# Altium project PCB_WMR_Project.PrjPcb
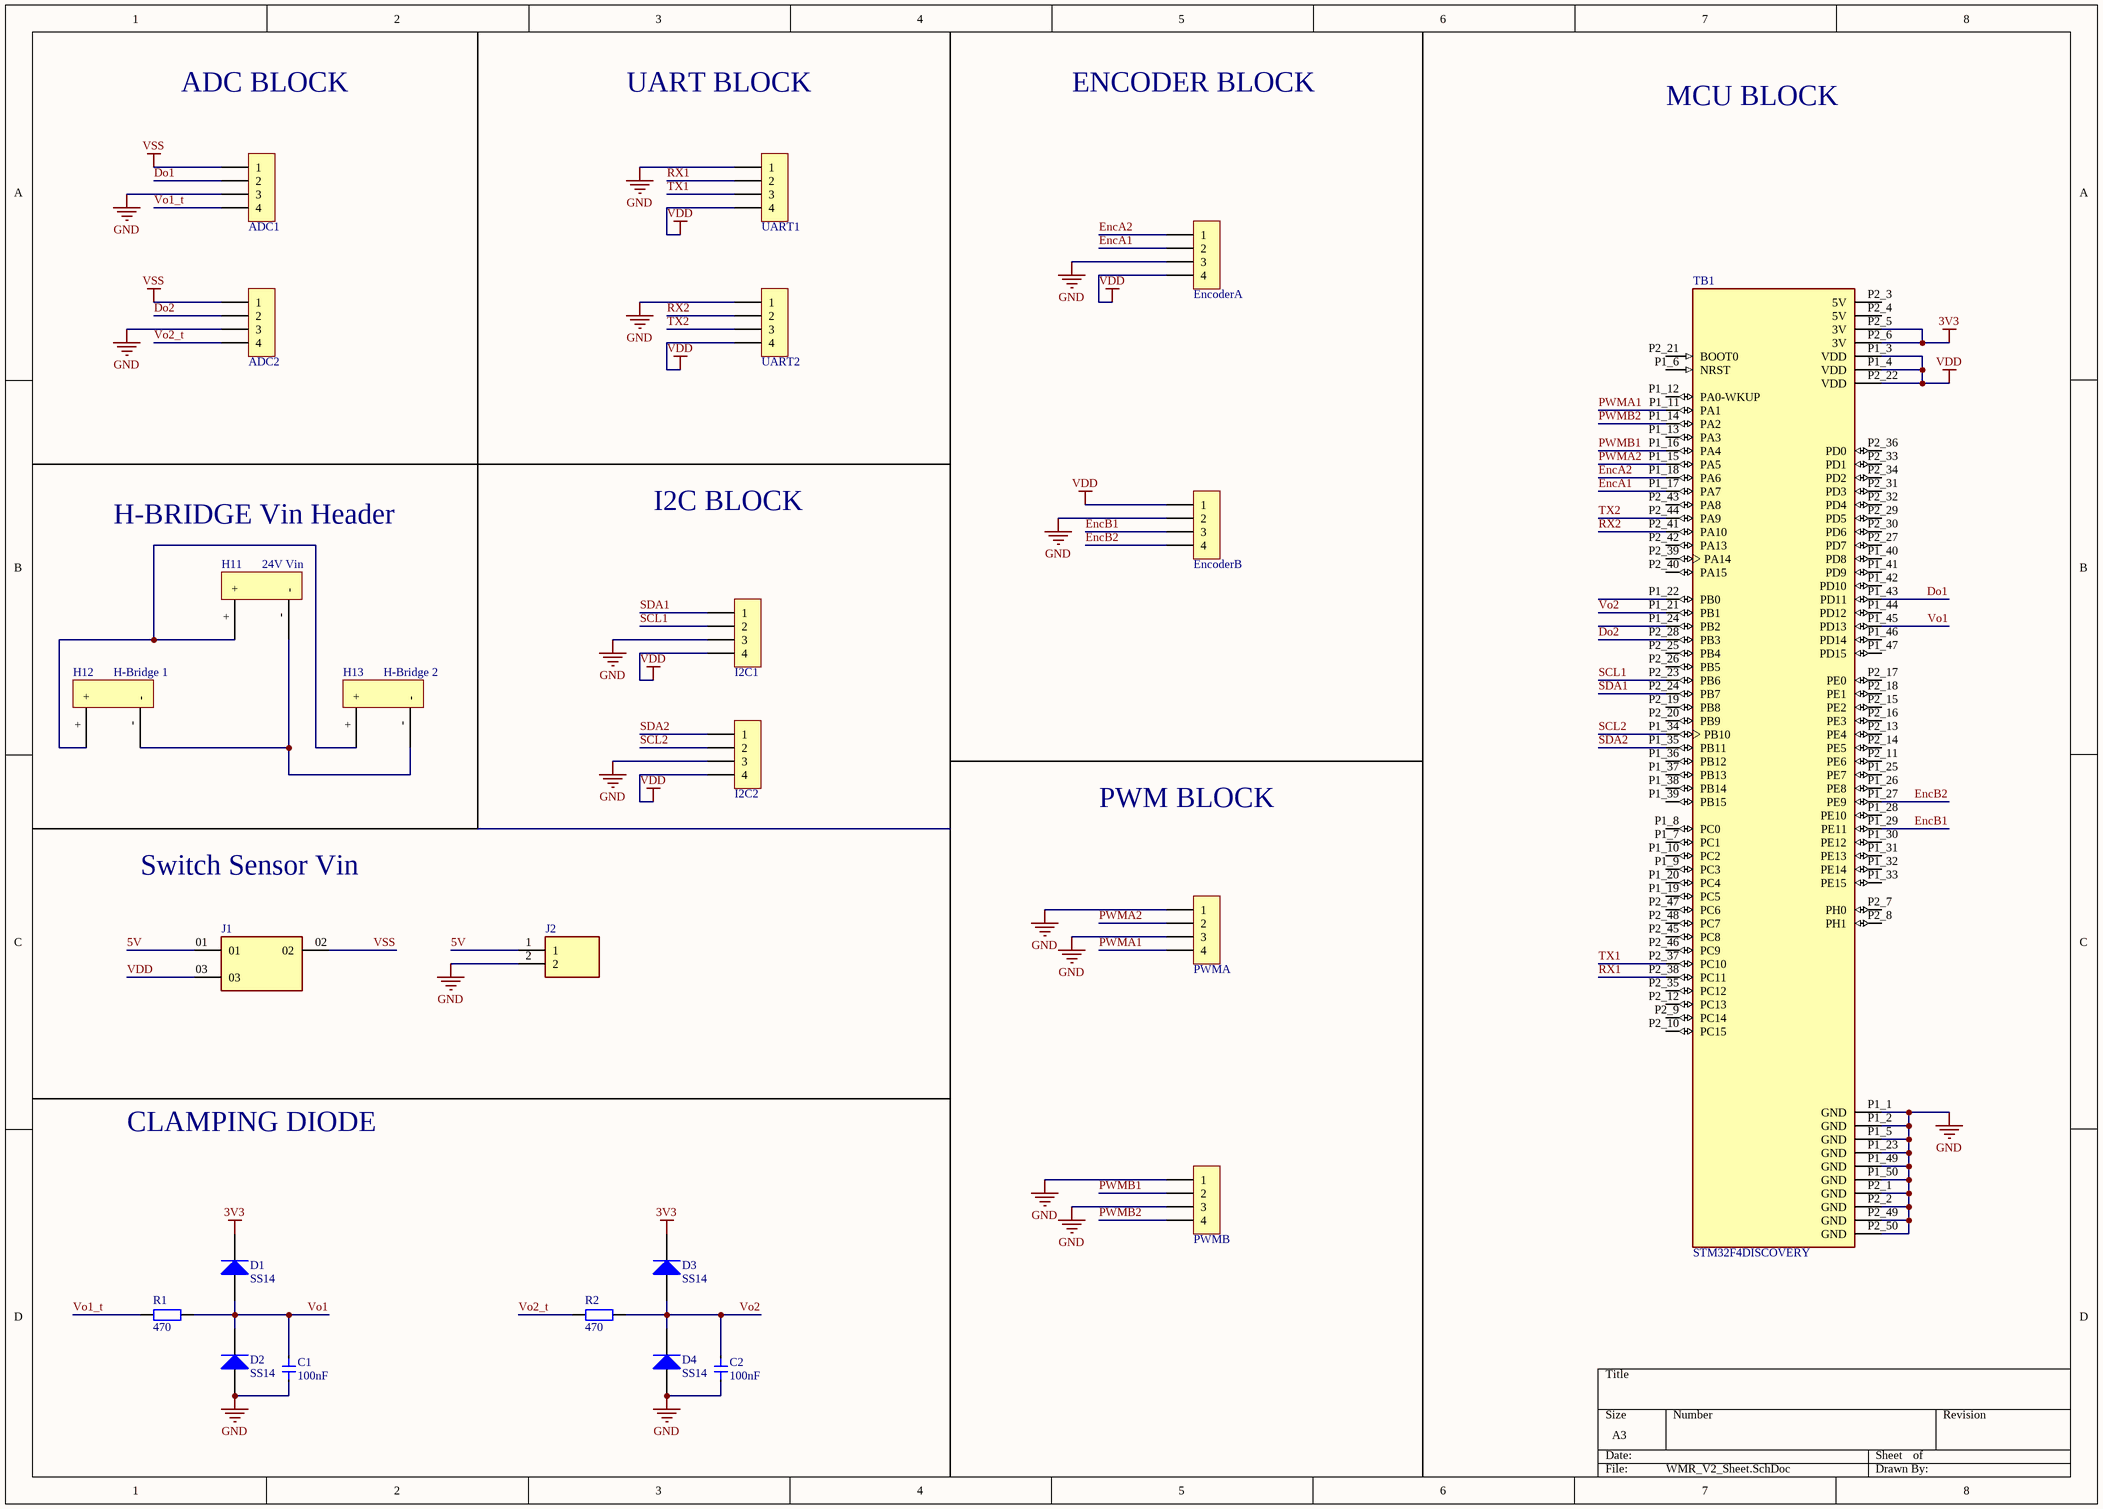
[diagram p0: WMR_V2_Sheet.SchDoc]
2 sheets, 47 parts. Net scope: global (net labels, ports and power ports of the same name join across sheets).
Board files: WMR_V2_PCB.PcbDoc, WMR_V3_PCB.PcbDoc
Sheets:
  WMR_V2_Sheet.SchDoc
  WMR_V3_Sheet.SchDoc

## Sheet WMR_V2_Sheet.SchDoc
size A3; SheetNumber: 1; SheetTotal: 2

### Parts
(Parts that share a designator on the sheet are numbered #1, #2 ... from top to bottom, then left to right.)
C1#1  100nF  [Cap 1206]
C2#1  100nF  [Cap 1206]
D1  SS14  [DIODE SMA]
D2  SS14  [DIODE SMA]
D3  SS14  [DIODE SMA]
D4  SS14  [DIODE SMA]
H1#1  EncoderA  [XH2.54M-4]
H2#1  EncoderB  [XH2.54M-4]
H3#1  PWMA  [XH2.54M-4]
H4  PWMB  [XH2.54M-4]
H5  UART1  [XH2.54M-4]
H6  UART2  [XH2.54M-4]
H7  I2C1  [XH2.54M-4]
H8  I2C2  [XH2.54M-4]
H9  ADC1  [XH2.54M-4]
H10  ADC2  [XH2.54M-4]
H11  24V Vin  [barrier_terminal]
H12  H-Bridge 1  [barrier_terminal]
H13  H-Bridge 2  [barrier_terminal]
J1#1  (no value)  [SAMTEC_TSW-101-07-G-T-LL]
J2#1  (no value)  [MULTICOMP_MC000048]
R1#1  470  [tro smd 1206]
R2#1  470  [tro smd 1206]
TB1#1  STM32F4DISCOVERY  [MODULE_STM32F4DISCOVERY]

### Nets
3V3: D1.2(K) D3.2(K) TB1#1.P2_5(3V) TB1#1.P2_6(3V)
5V: J1#1.01 J2#1.1
GND: C1#1.2 C2#1.2 D2.1(A) D4.1(A) H1#1.3 H2#1.2 H3#1.1 H3#1.3 H4.1 H4.3 H5.1 H6.1 H7.3 H8.3 H9.3 H10.3 J2#1.2 TB1#1.P1_1(GND) TB1#1.P1_2(GND) TB1#1.P1_5(GND) TB1#1.P1_23(GND) TB1#1.P1_49(GND) TB1#1.P1_50(GND) TB1#1.P2_1(GND) TB1#1.P2_2(GND) TB1#1.P2_49(GND) TB1#1.P2_50(GND)
VDD: H1#1.4 H2#1.1 H5.4 H6.4 H7.4 H8.4 J1#1.03 TB1#1.P1_3(VDD) TB1#1.P1_4(VDD) TB1#1.P2_22(VDD)
VSS: H9.1 H10.1 J1#1.02
Do1: H9.2 TB1#1.P1_43(PD11)
Do2: H10.2 TB1#1.P2_28(PB3)
EncA1: H1#1.2 TB1#1.P1_17(PA7)
EncA2: H1#1.1 TB1#1.P1_18(PA6)
EncB1: H2#1.3 TB1#1.P1_29(PE11)
EncB2: H2#1.4 TB1#1.P1_27(PE9)
PWMA1: H3#1.4 TB1#1.P1_11(PA1)
PWMA2: H3#1.2 TB1#1.P1_15(PA5)
PWMB1: H4.2 TB1#1.P1_16(PA4)
PWMB2: H4.4 TB1#1.P1_14(PA2)
RX1: H5.2 TB1#1.P2_38(PC11)
RX2: H6.2 TB1#1.P2_41(PA10)
SCL1: H7.2 TB1#1.P2_23(PB6)
SCL2: H8.2 TB1#1.P1_34(PB10)
SDA1: H7.1 TB1#1.P2_24(PB7)
SDA2: H8.1 TB1#1.P1_35(PB11)
TX1: H5.3 TB1#1.P2_37(PC10)
TX2: H6.3 TB1#1.P2_44(PA9)
Vo1: C1#1.1 D1.1(A) D2.2(K) R1#1.2 TB1#1.P1_45(PD13)
Vo1_t: H9.4 R1#1.1
Vo2: C2#1.1 D3.1(A) D4.2(K) R2#1.2 TB1#1.P1_21(PB1)
Vo2_t: H10.4 R2#1.1
NetH11_+: H11.+ H12.+ H13.+
NetH11_-: H11.- H12.- H13.-

Not connected (* = marked no-connect by the designer): TB1#1 P1_6(NRST) P1_7(PC1) P1_8(PC0) P1_9(PC3) P1_10(PC2) P1_12(PA0-WKUP) P1_13(PA3) P1_19(PC5) P1_20(PC4) P1_22(PB0) P1_24(PB2) P1_25(PE7) P1_26(PE8) P1_28(PE10) P1_30(PE12) P1_31(PE13) P1_32(PE14) P1_33(PE15) P1_36(PB12) P1_37(PB13) P1_38(PB14) P1_39(PB15) P1_40(PD8) P1_41(PD9) P1_42(PD10) P1_44(PD12) P1_46(PD14) P1_47(PD15) P2_3(5V) P2_4(5V) P2_7(PH0) P2_8(PH1) P2_9(PC14) P2_10(PC15) P2_11(PE6) P2_12(PC13) P2_13(PE4) P2_14(PE5) P2_15(PE2) P2_16(PE3) P2_17(PE0) P2_18(PE1) P2_19(PB8) P2_20(PB9) P2_21(BOOT0) P2_25(PB4) P2_26(PB5) P2_27(PD7) P2_29(PD5) P2_30(PD6) P2_31(PD3) P2_32(PD4) P2_33(PD1) P2_34(PD2) P2_35(PC12) P2_36(PD0) P2_39(PA14) P2_40(PA15) P2_42(PA13) P2_43(PA8) P2_45(PC8) P2_46(PC9) P2_47(PC6) P2_48(PC7)

### Notes on the sheet
- ADC BLOCK
- UART BLOCK
- ENCODER BLOCK
- MCU BLOCK
- I2C BLOCK
- H-BRIDGE Vin Header
- PWM BLOCK
- Switch Sensor Vin
- CLAMPING DIODE

### Library data of the parts
C1#1 C2#1 = Cap 1206: Capacitor SMD 1206
D1-D4 = Diode SS14 ( 1N5819): Dán; Ma_Hang: MH002211; Don_Vi: Con; Ten_Linh_Kien: Diode SS14 DO214 Schottky 1A 40V ( 1N5819 DO214); Chung_Loai: Dán; Ghi_Chu: *; Kieu_Chan: *
H1#1 H2#1 H3#1 H4-H10 = Header 4P 2.54 Duc Thang: Cắm; Ten_Linh_Kien: Header 4P XH2.54-4P Đực Thẳng; Don_Vi: Con; Ma_Hang: MH001285; Chung_Loai: Cắm
H11-H13 = Barrier Terminal
J1#1 = TSW-101-07-G-T-LL: Package: None; Price: None; Value: *; MP: TSW-101-07-G-T-LL; Availability: Unavailable
J2#1 = MC000048: TERMINAL BLOCK, PCB, 2WAY, 26-12AWG; Connector Type: PCB Terminal Block; Connector Mounting: PCB; Pitch Spacing: 5.08...; MF: Multicomp; SnapEDA_Link: https://www.snapeda.com/parts/MC000048/Multicomp/view-part/?ref=snap; Package: None; Value: *; MP: MC000048; Check_prices: https://www.snapeda.com/parts/MC000048/Multicomp/view-part/?ref=eda
R1#1 R2#1 = Tro 1206 1% 470k: Dán; Don_Vi: Con; Ten_Linh_Kien: Trở 1206 5% 470k; So_Chan: 2; Ma_Hang: MH005899; Chung_Loai: Dán; Kieu_Chan: *
TB1#1 = STM32F4DISCOVERY: Development kit: ARM ST; pin strips, pin header; No.of; Availability: Unavailable; MP: STM32F4DISCOVERY; Value: *; Price: None; Package: None

## Sheet WMR_V3_Sheet.SchDoc
size A3; SheetNumber: 2; SheetTotal: 2
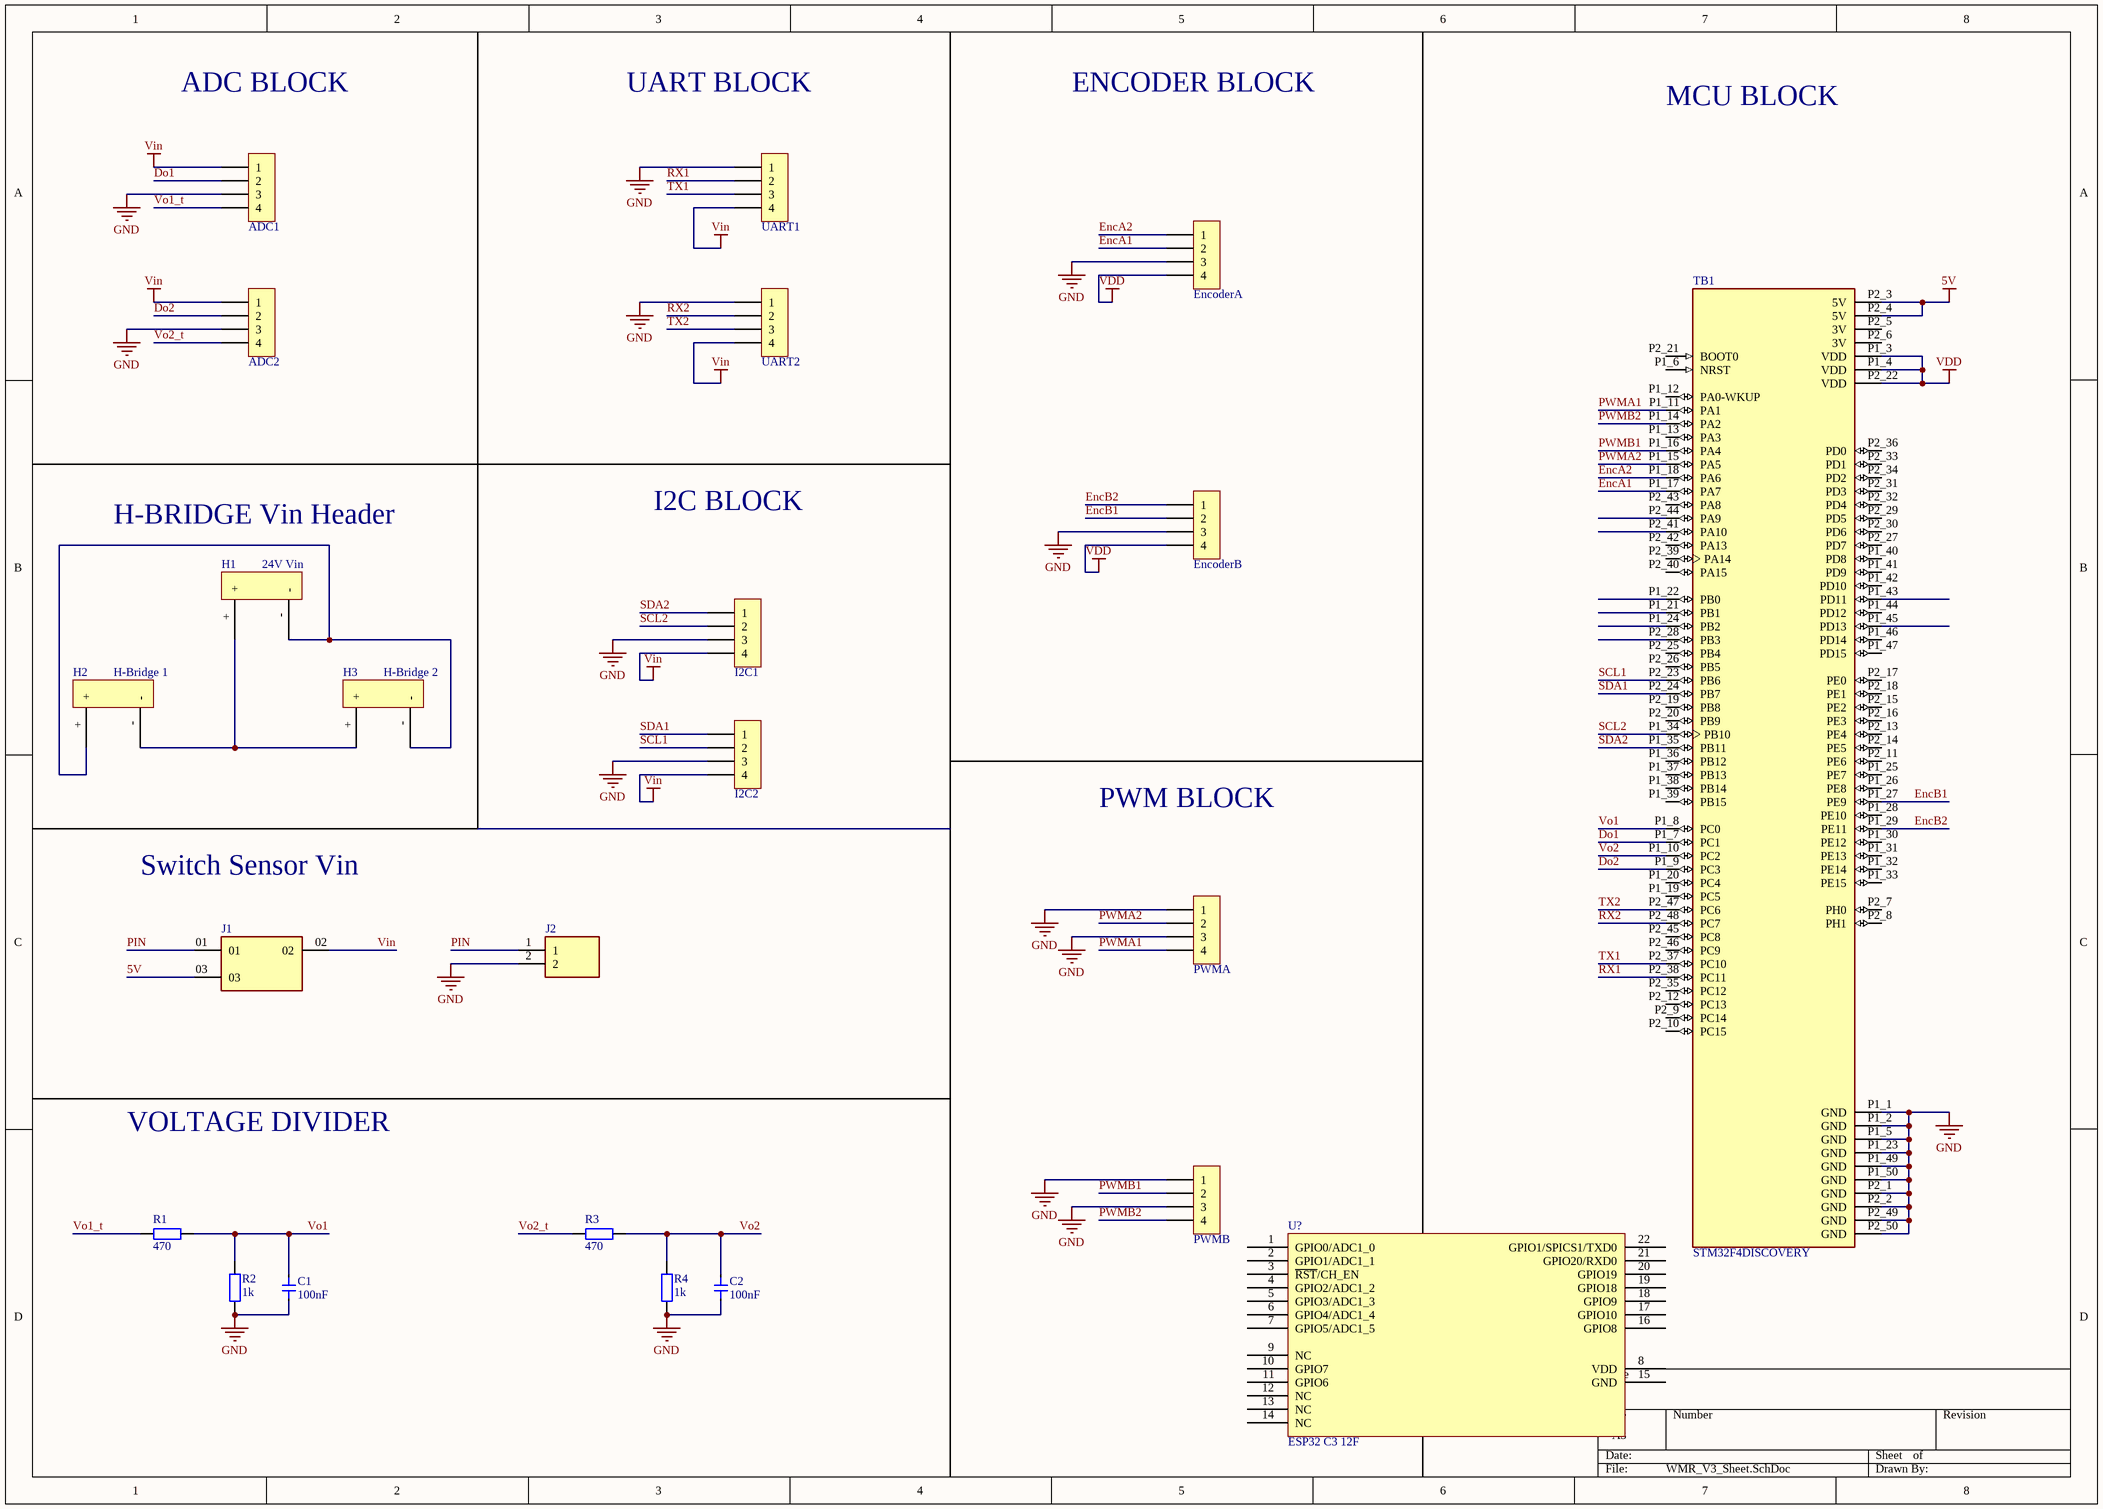
[diagram p1: WMR_V3_Sheet.SchDoc]

### Parts
(Parts that share a designator on the sheet are numbered #1, #2 ... from top to bottom, then left to right.)
C1#2  100nF  [Cap 1206]
C2#2  100nF  [Cap 1206]
H1#2  24V Vin  [barrier_terminal]
H2#2  H-Bridge 1  [barrier_terminal]
H3#2  H-Bridge 2  [barrier_terminal]
J1#2  (no value)  [SAMTEC_TSW-101-07-G-T-LL]
J2#2  (no value)  [MULTICOMP_MC000048]
R1#2  470  [tro smd 1206]
R2#2  1k  [tro smd 1206]
R3  470  [tro smd 1206]
R4  1k  [tro smd 1206]
TB1#2  STM32F4DISCOVERY  [MODULE_STM32F4DISCOVERY]
U?  ESP32 C3 12F  [ESP32 C3 12F]
XH1  EncoderA  [XH2.54M-4]
XH2  EncoderB  [XH2.54M-4]
XH3  PWMA  [XH2.54M-4]
XH4  PWMB  [XH2.54M-4]
XH5  UART1  [XH2.54M-4]
XH6  UART2  [XH2.54M-4]
XH7  I2C1  [XH2.54M-4]
XH8  I2C2  [XH2.54M-4]
XH9  ADC1  [XH2.54M-4]
XH10  ADC2  [XH2.54M-4]

### Nets
5V: J1#2.03 TB1#2.P2_3(5V) TB1#2.P2_4(5V)
GND: C1#2.2 C2#2.2 J2#2.2 R2#2.1 R4.1 TB1#2.P1_1(GND) TB1#2.P1_2(GND) TB1#2.P1_5(GND) TB1#2.P1_23(GND) TB1#2.P1_49(GND) TB1#2.P1_50(GND) TB1#2.P2_1(GND) TB1#2.P2_2(GND) TB1#2.P2_49(GND) TB1#2.P2_50(GND) XH1.3 XH2.3 XH3.1 XH3.3 XH4.1 XH4.3 XH5.1 XH6.1 XH7.3 XH8.3 XH9.3 XH10.3
VDD: TB1#2.P1_3(VDD) TB1#2.P1_4(VDD) TB1#2.P2_22(VDD) XH1.4 XH2.4
Vin: J1#2.02 XH5.4 XH6.4 XH7.4 XH8.4 XH9.1 XH10.1
Do1: TB1#2.P1_7(PC1) XH9.2
Do2: TB1#2.P1_9(PC3) XH10.2
EncA1: TB1#2.P1_17(PA7) XH1.2
EncA2: TB1#2.P1_18(PA6) XH1.1
EncB1: TB1#2.P1_27(PE9) XH2.2
EncB2: TB1#2.P1_29(PE11) XH2.1
PIN: J1#2.01 J2#2.1
PWMA1: TB1#2.P1_11(PA1) XH3.4
PWMA2: TB1#2.P1_15(PA5) XH3.2
PWMB1: TB1#2.P1_16(PA4) XH4.2
PWMB2: TB1#2.P1_14(PA2) XH4.4
RX1: TB1#2.P2_38(PC11) XH5.2
RX2: TB1#2.P2_48(PC7) XH6.2
SCL1: TB1#2.P2_23(PB6) XH8.2
SCL2: TB1#2.P1_34(PB10) XH7.2
SDA1: TB1#2.P2_24(PB7) XH8.1
SDA2: TB1#2.P1_35(PB11) XH7.1
TX1: TB1#2.P2_37(PC10) XH5.3
TX2: TB1#2.P2_47(PC6) XH6.3
Vo1: C1#2.1 R1#2.2 R2#2.2 TB1#2.P1_8(PC0)
Vo1_t: R1#2.1 XH9.4
Vo2: C2#2.1 R3.2 R4.2 TB1#2.P1_10(PC2)
Vo2_t: R3.1 XH10.4
NetH1#2_+: H1#2.+ H2#2.- H3#2.+
NetH1#2_-: H1#2.- H2#2.+ H3#2.-

Not connected (* = marked no-connect by the designer): TB1#2 P1_6(NRST) P1_12(PA0-WKUP) P1_13(PA3) P1_19(PC5) P1_20(PC4) P1_21(PB1) P1_22(PB0) P1_24(PB2) P1_25(PE7) P1_26(PE8) P1_28(PE10) P1_30(PE12) P1_31(PE13) P1_32(PE14) P1_33(PE15) P1_36(PB12) P1_37(PB13) P1_38(PB14) P1_39(PB15) P1_40(PD8) P1_41(PD9) P1_42(PD10) P1_43(PD11) P1_44(PD12) P1_45(PD13) P1_46(PD14) P1_47(PD15) P2_5(3V) P2_6(3V) P2_7(PH0) P2_8(PH1) P2_9(PC14) P2_10(PC15) P2_11(PE6) P2_12(PC13) P2_13(PE4) P2_14(PE5) P2_15(PE2) P2_16(PE3) P2_17(PE0) P2_18(PE1) P2_19(PB8) P2_20(PB9) P2_21(BOOT0) P2_25(PB4) P2_26(PB5) P2_27(PD7) P2_28(PB3) P2_29(PD5) P2_30(PD6) P2_31(PD3) P2_32(PD4) P2_33(PD1) P2_34(PD2) P2_35(PC12) P2_36(PD0) P2_39(PA14) P2_40(PA15) P2_41(PA10) P2_42(PA13) P2_43(PA8) P2_44(PA9) P2_45(PC8) P2_46(PC9); U? 1(GPIO0/ADC1_0) 2(GPIO1/ADC1_1) 3(~{RST}/CH_EN) 4(GPIO2/ADC1_2) 5(GPIO3/ADC1_3) 6(GPIO4/ADC1_4) 7(GPIO5/ADC1_5) 8(VDD) 9(NC) 10(GPIO7) 11(GPIO6) 12(NC) 13(NC) 14(NC) 15(GND) 16(GPIO8) 17(GPIO10) 18(GPIO9) 19(GPIO18) 20(GPIO19) 21(GPIO20/RXD0) 22(GPIO1/SPICS1/TXD0)

### Notes on the sheet
- ADC BLOCK
- UART BLOCK
- ENCODER BLOCK
- MCU BLOCK
- I2C BLOCK
- H-BRIDGE Vin Header
- PWM BLOCK
- Switch Sensor Vin
- VOLTAGE DIVIDER

### Library data of the parts
C1#2 C2#2 = Cap 1206: Capacitor SMD 1206
H1#2 H2#2 H3#2 = Barrier Terminal
J1#2 = TSW-101-07-G-T-LL: Package: None; Price: None; Value: *; MP: TSW-101-07-G-T-LL; Availability: Unavailable
J2#2 = MC000048: as J2#1 on sheet WMR_V2_Sheet; SnapEDA_Link: https://www.snapeda.com/parts/MC000048/Multicomp/view-part/?ref=snap; Package: None; Value: *; MP: MC000048; Check_prices: https://www.snapeda.com/parts/MC000048/Multicomp/view-part/?ref=eda
R1#2 R2#2 R3 R4 = Tro 1206 1% 470k: as R1#1 on sheet WMR_V2_Sheet; Chung_Loai: Dán; Kieu_Chan: *
TB1#2 = STM32F4DISCOVERY: as TB1#1 on sheet WMR_V2_Sheet; Availability: Unavailable; MP: STM32F4DISCOVERY; Value: *; Price: None; Package: None
U? = ESP32 C3 12F: IC: ESP8266-EX; Vendor: Ai-thinker
XH1-XH10 = Header 4P 2.54 Duc Thang: as H1#1 on sheet WMR_V2_Sheet; Chung_Loai: Cắm

## Nets that join several sheets
5V: WMR_V2_Sheet (J1#1.01 J2#1.1), WMR_V3_Sheet (J1#2.03 TB1#2.P2_3 TB1#2.P2_4)
GND: WMR_V2_Sheet (27 pins), WMR_V3_Sheet (27 pins)
VDD: WMR_V2_Sheet (10 pins), WMR_V3_Sheet (5 pins)
Do1: WMR_V2_Sheet (H9.2 TB1#1.P1_43), WMR_V3_Sheet (TB1#2.P1_7 XH9.2)
Do2: WMR_V2_Sheet (H10.2 TB1#1.P2_28), WMR_V3_Sheet (TB1#2.P1_9 XH10.2)
EncA1: WMR_V2_Sheet (H1#1.2 TB1#1.P1_17), WMR_V3_Sheet (TB1#2.P1_17 XH1.2)
EncA2: WMR_V2_Sheet (H1#1.1 TB1#1.P1_18), WMR_V3_Sheet (TB1#2.P1_18 XH1.1)
EncB1: WMR_V2_Sheet (H2#1.3 TB1#1.P1_29), WMR_V3_Sheet (TB1#2.P1_27 XH2.2)
EncB2: WMR_V2_Sheet (H2#1.4 TB1#1.P1_27), WMR_V3_Sheet (TB1#2.P1_29 XH2.1)
PWMA1: WMR_V2_Sheet (H3#1.4 TB1#1.P1_11), WMR_V3_Sheet (TB1#2.P1_11 XH3.4)
PWMA2: WMR_V2_Sheet (H3#1.2 TB1#1.P1_15), WMR_V3_Sheet (TB1#2.P1_15 XH3.2)
PWMB1: WMR_V2_Sheet (H4.2 TB1#1.P1_16), WMR_V3_Sheet (TB1#2.P1_16 XH4.2)
PWMB2: WMR_V2_Sheet (H4.4 TB1#1.P1_14), WMR_V3_Sheet (TB1#2.P1_14 XH4.4)
RX1: WMR_V2_Sheet (H5.2 TB1#1.P2_38), WMR_V3_Sheet (TB1#2.P2_38 XH5.2)
RX2: WMR_V2_Sheet (H6.2 TB1#1.P2_41), WMR_V3_Sheet (TB1#2.P2_48 XH6.2)
SCL1: WMR_V2_Sheet (H7.2 TB1#1.P2_23), WMR_V3_Sheet (TB1#2.P2_23 XH8.2)
SCL2: WMR_V2_Sheet (H8.2 TB1#1.P1_34), WMR_V3_Sheet (TB1#2.P1_34 XH7.2)
SDA1: WMR_V2_Sheet (H7.1 TB1#1.P2_24), WMR_V3_Sheet (TB1#2.P2_24 XH8.1)
SDA2: WMR_V2_Sheet (H8.1 TB1#1.P1_35), WMR_V3_Sheet (TB1#2.P1_35 XH7.1)
TX1: WMR_V2_Sheet (H5.3 TB1#1.P2_37), WMR_V3_Sheet (TB1#2.P2_37 XH5.3)
TX2: WMR_V2_Sheet (H6.3 TB1#1.P2_44), WMR_V3_Sheet (TB1#2.P2_47 XH6.3)
Vo1: WMR_V2_Sheet (5 pins), WMR_V3_Sheet (C1#2.1 R1#2.2 R2#2.2 TB1#2.P1_8)
Vo1_t: WMR_V2_Sheet (H9.4 R1#1.1), WMR_V3_Sheet (R1#2.1 XH9.4)
Vo2: WMR_V2_Sheet (5 pins), WMR_V3_Sheet (C2#2.1 R3.2 R4.2 TB1#2.P1_10)
Vo2_t: WMR_V2_Sheet (H10.4 R2#1.1), WMR_V3_Sheet (R3.1 XH10.4)